# Altium schematic sheet MCU_and_Digital.SchDoc
size A; SheetNumber: 2; SheetTotal: 4
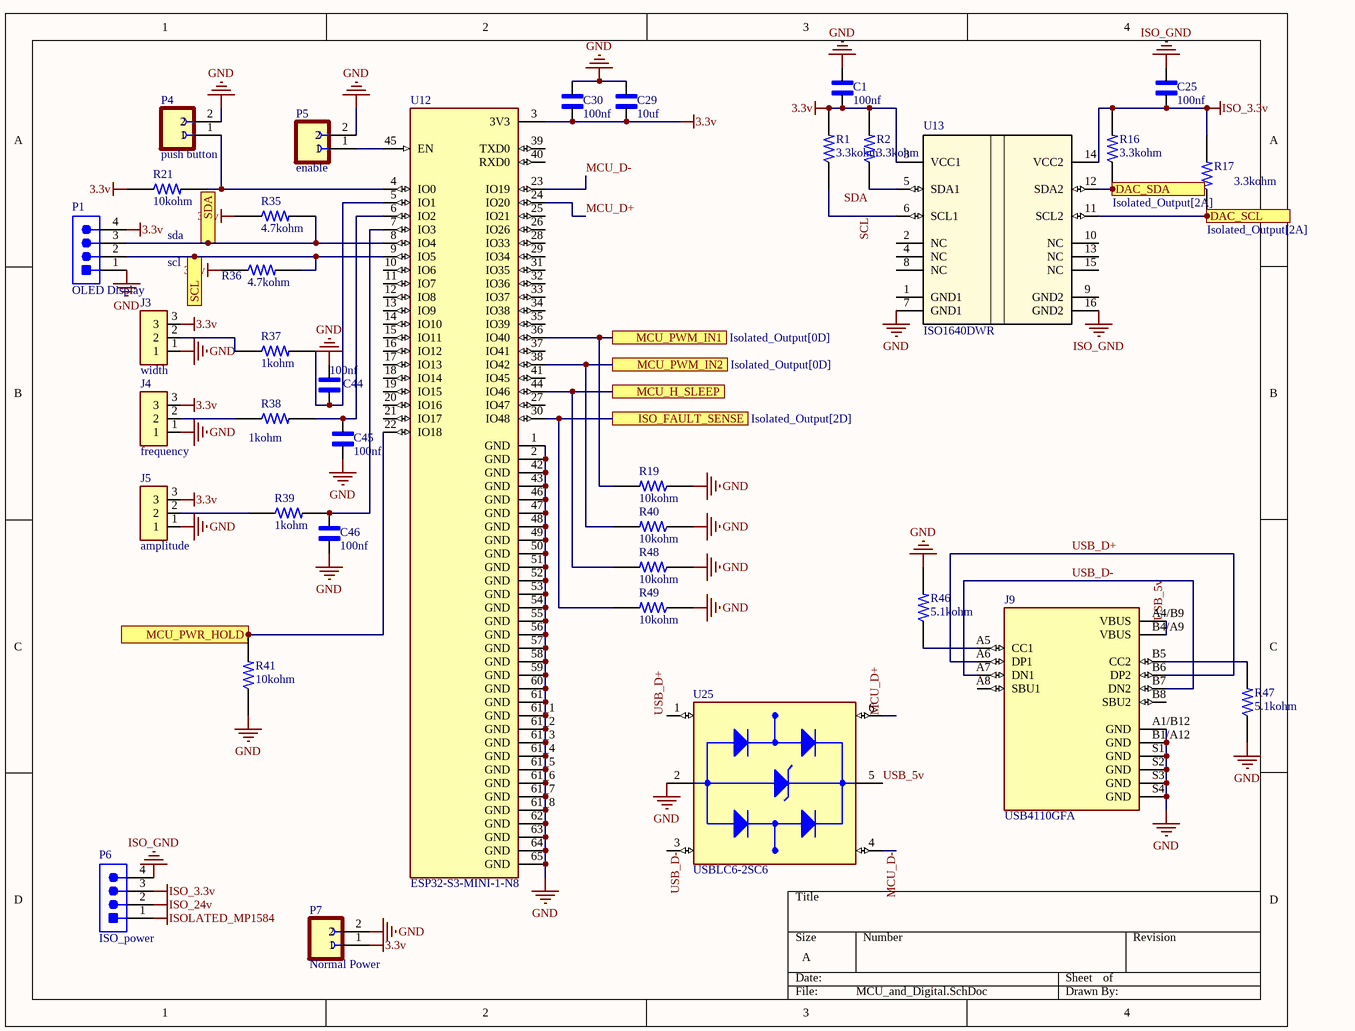
[diagram p0: MCU_and_Digital.SchDoc]

## Parts
C1  100nf  [CAPC1608X90]
C25  100nf  [CAPC1608X90]
C29  10uf  [RESC3216X125N]
C30  100nf  [CAPC1608X90]
C44  100nf  [CAPC1608X90]
C45  100nf  [CAPC1608X90]
C46  100nf  [CAPC1608X90]
J3  width  [JST_S3B-PH-SM4-TB(LF)(SN)]
J4  frequency  [JST_S3B-PH-SM4-TB(LF)(SN)]
J5  amplitude  [JST_S3B-PH-SM4-TB(LF)(SN)]
J9  USB4110GFA  [GCT_USB4110GFA]
P1  OLED Display  [JST-S4B-XH-A(LF)(SN)_V]
P4  push button  [JST_PHR-2]
P5  enable  [JST_PHR-2]
P6  ISO_power  [JST-S4B-XH-A(LF)(SN)_V]
P7  Normal Power  [JST_PHR-2]
R1  3.3kohm  [RESC1607X60N]
R2  3.3kohm  [RESC1607X60N]
R16  3.3kohm  [RESC1607X60N]
R17  3.3kohm  [RESC1607X60N]
R19  10kohm  [RESC1607X60N]
R21  10kohm  [RESC1607X60N]
R35  4.7kohm  [RESC1607X60N]
R36  4.7kohm  [RESC1607X60N]
R37  1kohm  [RESC1607X60N]
R38  1kohm  [RESC1607X60N]
R39  1kohm  [RESC1607X60N]
R40  10kohm  [RESC1607X60N]
R41  10kohm  [RESC1607X60N]
R46  5.1kohm  [RESC1607X60N]
R47  5.1kohm  [RESC1607X60N]
R48  10kohm  [RESC1607X60N]
R49  10kohm  [RESC1607X60N]
U12  ESP32-S3-MINI-1-N8  [XCVR_ESP32-S3-MINI-1-N8]
U13  ISO1640DWR  [DW0016A-IPC_A]
U25  USBLC6-2SC6  [SOT95P280X145-6N]

## Ports
DAC_SCL (see Isolated_Output[2A]), DAC_SDA (see Isolated_Output[2A]), ISO_FAULT_SENSE (see Isolated_Output[2D]), MCU_H_SLEEP, MCU_PWM_IN1 (see Isolated_Output[0D]), MCU_PWM_IN2 (see Isolated_Output[0D]), MCU_PWR_HOLD, SCL, SDA

## Nets
3.3v: C1.2 C29.1 C30.2 J3.3 J4.3 J5.3 P1.4 P7.1 R1.2 R2.2 R21.1 R35.1 R36.1 U12.3(3V3) U13.3(VCC1)
GND: C1.1 C29.2 C30.1 C44.1 C45.1 C46.1 J3.1 J4.1 J5.1 J9.A1/B12(GND) J9.B1/A12(GND) J9.S1(GND) J9.S2(GND) J9.S3(GND) J9.S4(GND) P1.1 P4.2 P5.2 P7.2 R19.1 R40.1 R41.1 R46.2 R47.1 R48.1 R49.1 U12.1(GND) U12.2(GND) U12.42(GND) U12.43(GND) U12.46(GND) U12.47(GND) U12.48(GND) U12.49(GND) U12.50(GND) U12.51(GND) U12.52(GND) U12.53(GND) U12.54(GND) U12.55(GND) U12.56(GND) U12.57(GND) U12.58(GND) U12.59(GND) U12.60(GND) U12.61(GND) U12.61_1(GND) U12.61_2(GND) U12.61_3(GND) U12.61_4(GND) U12.61_5(GND) U12.61_6(GND) U12.61_7(GND) U12.61_8(GND) U12.62(GND) U12.63(GND) U12.64(GND) U12.65(GND) U13.7(GND1) U25.2(GND)
ISO_3.3v: C25.2 P6.3 R16.2 R17.2 U13.14(VCC2)
ISO_24v: P6.2
ISO_GND: C25.1 P6.4 U13.16(GND2)
ISOLATED_MP1584: P6.1
DAC_SCL: R17.1 U13.11(SCL2) ; port DAC_SCL
DAC_SDA: R16.1 U13.12(SDA2) ; port DAC_SDA
ISO_FAULT_SENSE: R49.2 U12.30(IO48) ; port ISO_FAULT_SENSE
MCU_D+: U12.24(IO20) U25.6(I/O1_OUT)
MCU_D-: U12.23(IO19) U25.4(I/O2_OUT)
MCU_H_SLEEP: R48.2 U12.44(IO46) ; port MCU_H_SLEEP
MCU_PWM_IN1: R19.2 U12.36(IO40) ; port MCU_PWM_IN1
MCU_PWM_IN2: R40.2 U12.38(IO42) ; port MCU_PWM_IN2
MCU_PWR_HOLD: R41.2 U12.22(IO18) ; port MCU_PWR_HOLD
SCL: P1.2 R36.2 U12.9(IO5) ; port SCL
SCL: R1.1 U13.6(SCL1)  [a separate net that carries the same name]
SDA: P1.3 R35.2 U12.8(IO4) ; port SDA
SDA: R2.1 U13.5(SDA1)  [a separate net that carries the same name]
USB_5v: J9.A4/B9(VBUS) J9.B4/A9(VBUS) U25.5(VBUS)
USB_D+: J9.A6(DP1) J9.B6(DP2) U25.1(I/O1_IN)
USB_D-: J9.A7(DN1) J9.B7(DN2) U25.3(I/O2_IN)
NetC44_2: C44.2 R37.2 U12.5(IO1)
NetC45_2: C45.2 R38.2 U12.6(IO2)
NetC46_2: C46.2 R39.2 U12.7(IO3)
NetJ3_2: J3.2 R37.1
NetJ4_2: J4.2 R38.1
NetJ5_2: J5.2 R39.1
NetJ9_A5: J9.A5(CC1) R46.1
NetJ9_B5: J9.B5(CC2) R47.2
NetP4_1: P4.1 R21.2 U12.4(IO0)
NetP5_1: P5.1 U12.45(EN)

Not connected (* = marked no-connect by the designer): J9 A8(SBU1) B8(SBU2); U12 10(IO6) 11(IO7) 12(IO8) 13(IO9) 14(IO10) 15(IO11) 16(IO12) 17(IO13) 18(IO14) 19(IO15) 20(IO16) 21(IO17) 25(IO21) 26(IO26) 27(IO47) 28(IO33) 29(IO34) 31(IO35) 32(IO36) 33(IO37) 34(IO38) 35(IO39) 37(IO41) 39(TXD0) 40(RXD0) 41(IO45); U13 1(GND1) 2(NC) 4(NC) 8(NC) 9(GND2) 10(NC) 13(NC) 15(NC)

## Notes on the sheet
- (near R21) sda
- scl

## Library data of the parts
C1 C25 C30 C44-C46 = C0603KRX7R9BB102: 0603 1 nF 50 V Â±10 % Tolerance X7R Surface Mount Ceramic Capacitor; MF: Yageo; SnapEDA_Link: https://www.snapeda.com/parts/C0603KRX7R9BB102/Yageo/view-part/?ref=snap; Package: 0603 Yageo; Value: *; MP: C0603KRX7R9BB102; Check_prices: https://www.snapeda.com/parts/C0603KRX7R9BB102/Yageo/view-part/?ref=eda
C29 = T491A106K016AT: Capacitors Tantalum PCB 10uF SMD Tol 10% 16 VDC Case Size 3216 T491 Series | KEMET T491A106K016AT; SnapEDA_Link: https://www.snapeda.com/parts/T491A106K016AT/KEMET/view-part/?ref=snap; Package: SMD-2 KEMET; Value: *; MF: KEMET; MP: T491A106K016AT; Check_prices: https://www.snapeda.com/parts/T491A106K016AT/KEMET/view-part/?ref=eda
J3-J5 = S3B-PH-SM4-TB(LF)(SN): Connector Header Surface Mount, Right Angle 3 position 0.079 (2.00mm); MF: JST Sales; SnapEDA_Link: https://www.snapeda.com/parts/S3B-PH-SM4-TB%20(LF)(SN)/JST/view-part/?ref=snap; Package: None; Value: *; MP: S3B-PH-SM4-TB (LF)(SN); Check_prices: https://www.snapeda.com/parts/S3B-PH-SM4-TB%20(LF)(SN)/JST/view-part/?ref=eda
J9 = USB4110GFA: USB-C (USB TYPE-C) USB 2.0 Receptacle Connector 24 (16+8 Dummy) Position Surface Mount, Right Angle; MF: Global Connector Technology; SnapEDA_Link: https://www.snapeda.com/parts/USB4110GFA/Global+Connector+Technology/view-part/?ref=snap; Package: None; Value: *; MP: USB4110GFA; Check_prices: https://www.snapeda.com/parts/USB4110GFA/Global+Connector+Technology/view-part/?ref=eda
P1 P6 = CMP-1755-00007-1: Male Header, Pitch 2.5 mm, 1 x 4 Position, Height 6.1 mm, Tail Length 3.4 mm, -25 to 85 degC, RoHS, Bulk; PackageReference: S4B-XH-A(LF)(SN); ComponentLink1Description: Manufacturer URL; DatasheetVersion: May-16; ComponentLink2Description: Datasheet; ComponentLink2URL: http://www.jst-mfg.com/product/pdf/eng/eXH.pdf; ComponentLink1URL: http://www.jst.com/home2.html; PackageDescription: Male Header, Pitch 2.5 mm, 1 x 4 Position, Height 6.1 mm, Tail Length 3.4 mm
P4 P5 P7 = PHR-2: PH Series 2 Position 2 mm Pitch Free Hanging Housing Connector; Value: *; MP: PHR-2; Package: None; Availability: Unavailable; Price: None
R1 R2 R16 R17 R19 R21 R35-R41 R46-R49 = RC0603JR-0710KL: 10 kOhms Â±5% 0.1W, 1/10W Chip Resistor 0603 (1608 Metric) Moisture Resistant Thick Film; MF: Yageo; SnapEDA_Link: https://www.snapeda.com/parts/RC0603JR-0710KL/Yageo/view-part/?ref=snap; Package: 0603 Yageo; Value: *; MP: RC0603JR-0710KL; Check_prices: https://www.snapeda.com/parts/RC0603JR-0710KL/Yageo/view-part/?ref=eda
U12 = ESP32-S3-MINI-1-N8: MF: {'manufacturer': u'Espressif Systems'}; Package: None; Price: None; Value: *; MP: ESP32-S3-MINI-1-N8; Availability: Unavailable
U13 = ISO1640DWR: Hot-swappable, robust-EMC bidirectional I2C isolator with bidirectional clock 16-SOIC -40 to 125; Manufacturer_Name: Texas Instruments; TYPE: TYPE; RefDes: RefDes; Copyright: Copyright (C) 2025 Ultra Librarian. All rights reserved.; Manufacturer_Part_Number: ISO1640DWR
U25 = USBLC6-2SC6: 17V Clamp 5A (8/20Âµs) Ipp Tvs Diode Surface Mount SOT-23-6; MF: STMicroelectronics; Value: *; SnapEDA_Link: https://www.snapeda.com/parts/USBLC6-2SC6/STMicroelectronics/view-part/?ref=snap; Check_prices: https://www.snapeda.com/parts/USBLC6-2SC6/STMicroelectronics/view-part/?ref=eda; Purchase-URL: https://pricing.snapeda.com/search/part/USBLC6-2SC6/?ref=eda; Price: None; Availability: In Stock; Package: SOT-23-6 STMicroelectronics; MP: USBLC6-2SC6